# EAGLE schematic Coil 22_10_1.8 v5 (EAGLE 9.7.0)
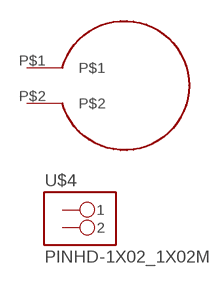
[diagram p0: schematic, sheet 1]

## Parts
U$3  COIL_22_10_1.8  [COIL_22_10_1.8]
U$4  PINHD-1X02_1X02M  [1X02]
Unconnected: U$3.P$1 U$3.P$2 U$4.1 U$4.2

## Library data of the parts
U$3 = Trace_Coils:COIL_22_10_1.8
U$4 = Tinkercad:PINHD-1X02